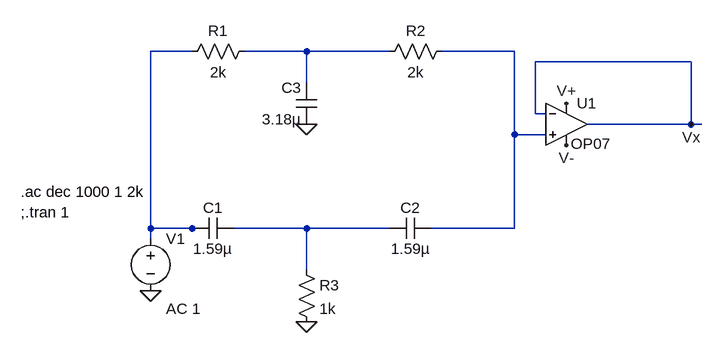
[diagram p0: schematic Notch Filter.asc]
Notch Filter.asc, the LTspice schematic file:
Version 4.1
SHEET 1 880 680
WIRE -224 -16 -288 -16
WIRE -48 -16 -144 -16
WIRE 80 -16 -48 -16
WIRE 272 -16 160 -16
WIRE 544 0 304 0
WIRE -48 32 -48 -16
WIRE 304 80 304 0
WIRE 320 80 304 80
WIRE 544 96 544 0
WIRE 544 96 384 96
WIRE 560 96 544 96
WIRE 272 112 272 -16
WIRE 320 112 272 112
WIRE -288 256 -288 -16
WIRE -224 256 -288 256
WIRE -208 256 -224 256
WIRE -48 256 -160 256
WIRE 80 256 -48 256
WIRE 272 256 272 112
WIRE 272 256 144 256
WIRE -288 272 -288 256
WIRE -48 320 -48 256
FLAG -48 96 0
FLAG -48 400 0
FLAG 352 64 V+
FLAG 352 128 V-
FLAG -288 352 0
FLAG 544 96 Vx
SYMBOL cap -160 240 R90
WINDOW 0 0 32 VBottom 2
WINDOW 3 32 32 VTop 2
SYMATTR InstName C1
SYMATTR Value 1.59µ
SYMBOL cap 144 240 R90
WINDOW 0 0 32 VBottom 2
WINDOW 3 32 32 VTop 2
SYMATTR InstName C2
SYMATTR Value 1.59µ
SYMBOL cap -32 96 R180
WINDOW 0 24 56 Left 2
WINDOW 3 24 8 Left 2
SYMATTR InstName C3
SYMATTR Value 3.18µ
SYMBOL res -128 -32 R90
WINDOW 0 0 56 VBottom 2
WINDOW 3 32 56 VTop 2
SYMATTR InstName R1
SYMATTR Value 2k
SYMBOL res 176 -32 R90
WINDOW 0 0 56 VBottom 2
WINDOW 3 32 56 VTop 2
SYMATTR InstName R2
SYMATTR Value 2k
SYMBOL OpAmps\\OP07 352 32 R0
WINDOW 3 7 94 Left 2
SYMATTR InstName U1
SYMBOL res -64 304 R0
SYMATTR InstName R3
SYMATTR Value 1k
SYMBOL voltage -288 256 R0
WINDOW 123 24 124 Left 2
WINDOW 39 0 0 Left 0
SYMATTR InstName V1
SYMATTR Value ""
SYMATTR Value2 AC 1
TEXT -488 200 Left 2 !.ac dec 1000 1 2k\n;.tran 1

The netlist it stands for:
* Notch Filter.asc
C1 N004 N001 1.59µ
C2 N003 N004 1.59µ
C3 0 N002 3.18µ
R1 N002 N001 2k
R2 N003 N002 2k
X§U1 N003 Vx V+ V- Vx LT1001  ; OP07, pins In+ In- V+ V- OUT
R3 N004 0 1k
V1 N001 0 AC 1
.ac dec 1000 1 2k
;.tran 1
.lib LTC.lib
.backanno
.end